# Altium project vd.PrjPcb
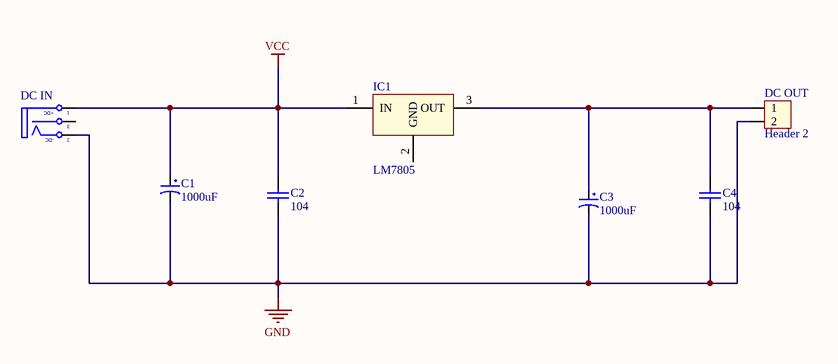
[diagram p0: schematic.SchDoc]
1 sheet, 7 parts. Net scope: global (net labels, ports and power ports of the same name join across sheets).
Board file: PCB.PcbDoc

## Sheet schematic.SchDoc
size A; SheetNumber: 1; SheetTotal: 1

### Parts
C1  1000uF  [tu hoa 8mm]
C2  104  [tu gom]
C3  1000uF  [tu hoa 8mm]
C4  104  [tu gom]
DC_IN  JACK DC 5.5  [JACK DC 5.5]  (value not drawn)
DC_OUT  Header 2  [HED2]
IC1  LM7805  [QTO-220]

### Nets
GND: C1.2 C2.2 C3.2 C4.2 DC_IN.2(TN) DC_OUT.2
VCC: C1.1 C2.1 DC_IN.1(T) IC1.1(IN)
NetC3_1: C3.1 C4.1 DC_OUT.1 IC1.3(OUT)

Not connected (* = marked no-connect by the designer): DC_IN 3(S); IC1 2(GND)

### Library data of the parts
C1 C3 = Tu Hoa 1000uF 16V 8x20: Cắm; Don_Vi: Con; So_Chan: 2; Ten_Linh_Kien: Tụ Hóa 1000uF 16V 8x20MM; Ma_Hang: MH008300; Chung_Loai: Cắm; Kieu_Chan: *
C2 C4 = Tu gom 104 50V: Cắm; So_Chan: 2; Ten_Linh_Kien: Tụ gốm 104 100nF 50V; Don_Vi: Con; Ma_Hang: MH004761; Chung_Loai: Cắm; Kieu_Chan: *
DC_IN = JACK DC 5.5: Value: Jac DC
DC_OUT = Hed2: Header 2 (Green); Value: Header 2
IC1 = LM78xx: On ap +, from + 5 to + 24VDC; Value: LM7805